# Altium schematic sheet kk_sem_ultrahang_hw.SchDoc
size A3; SheetNumber: 1; SheetTotal: 1
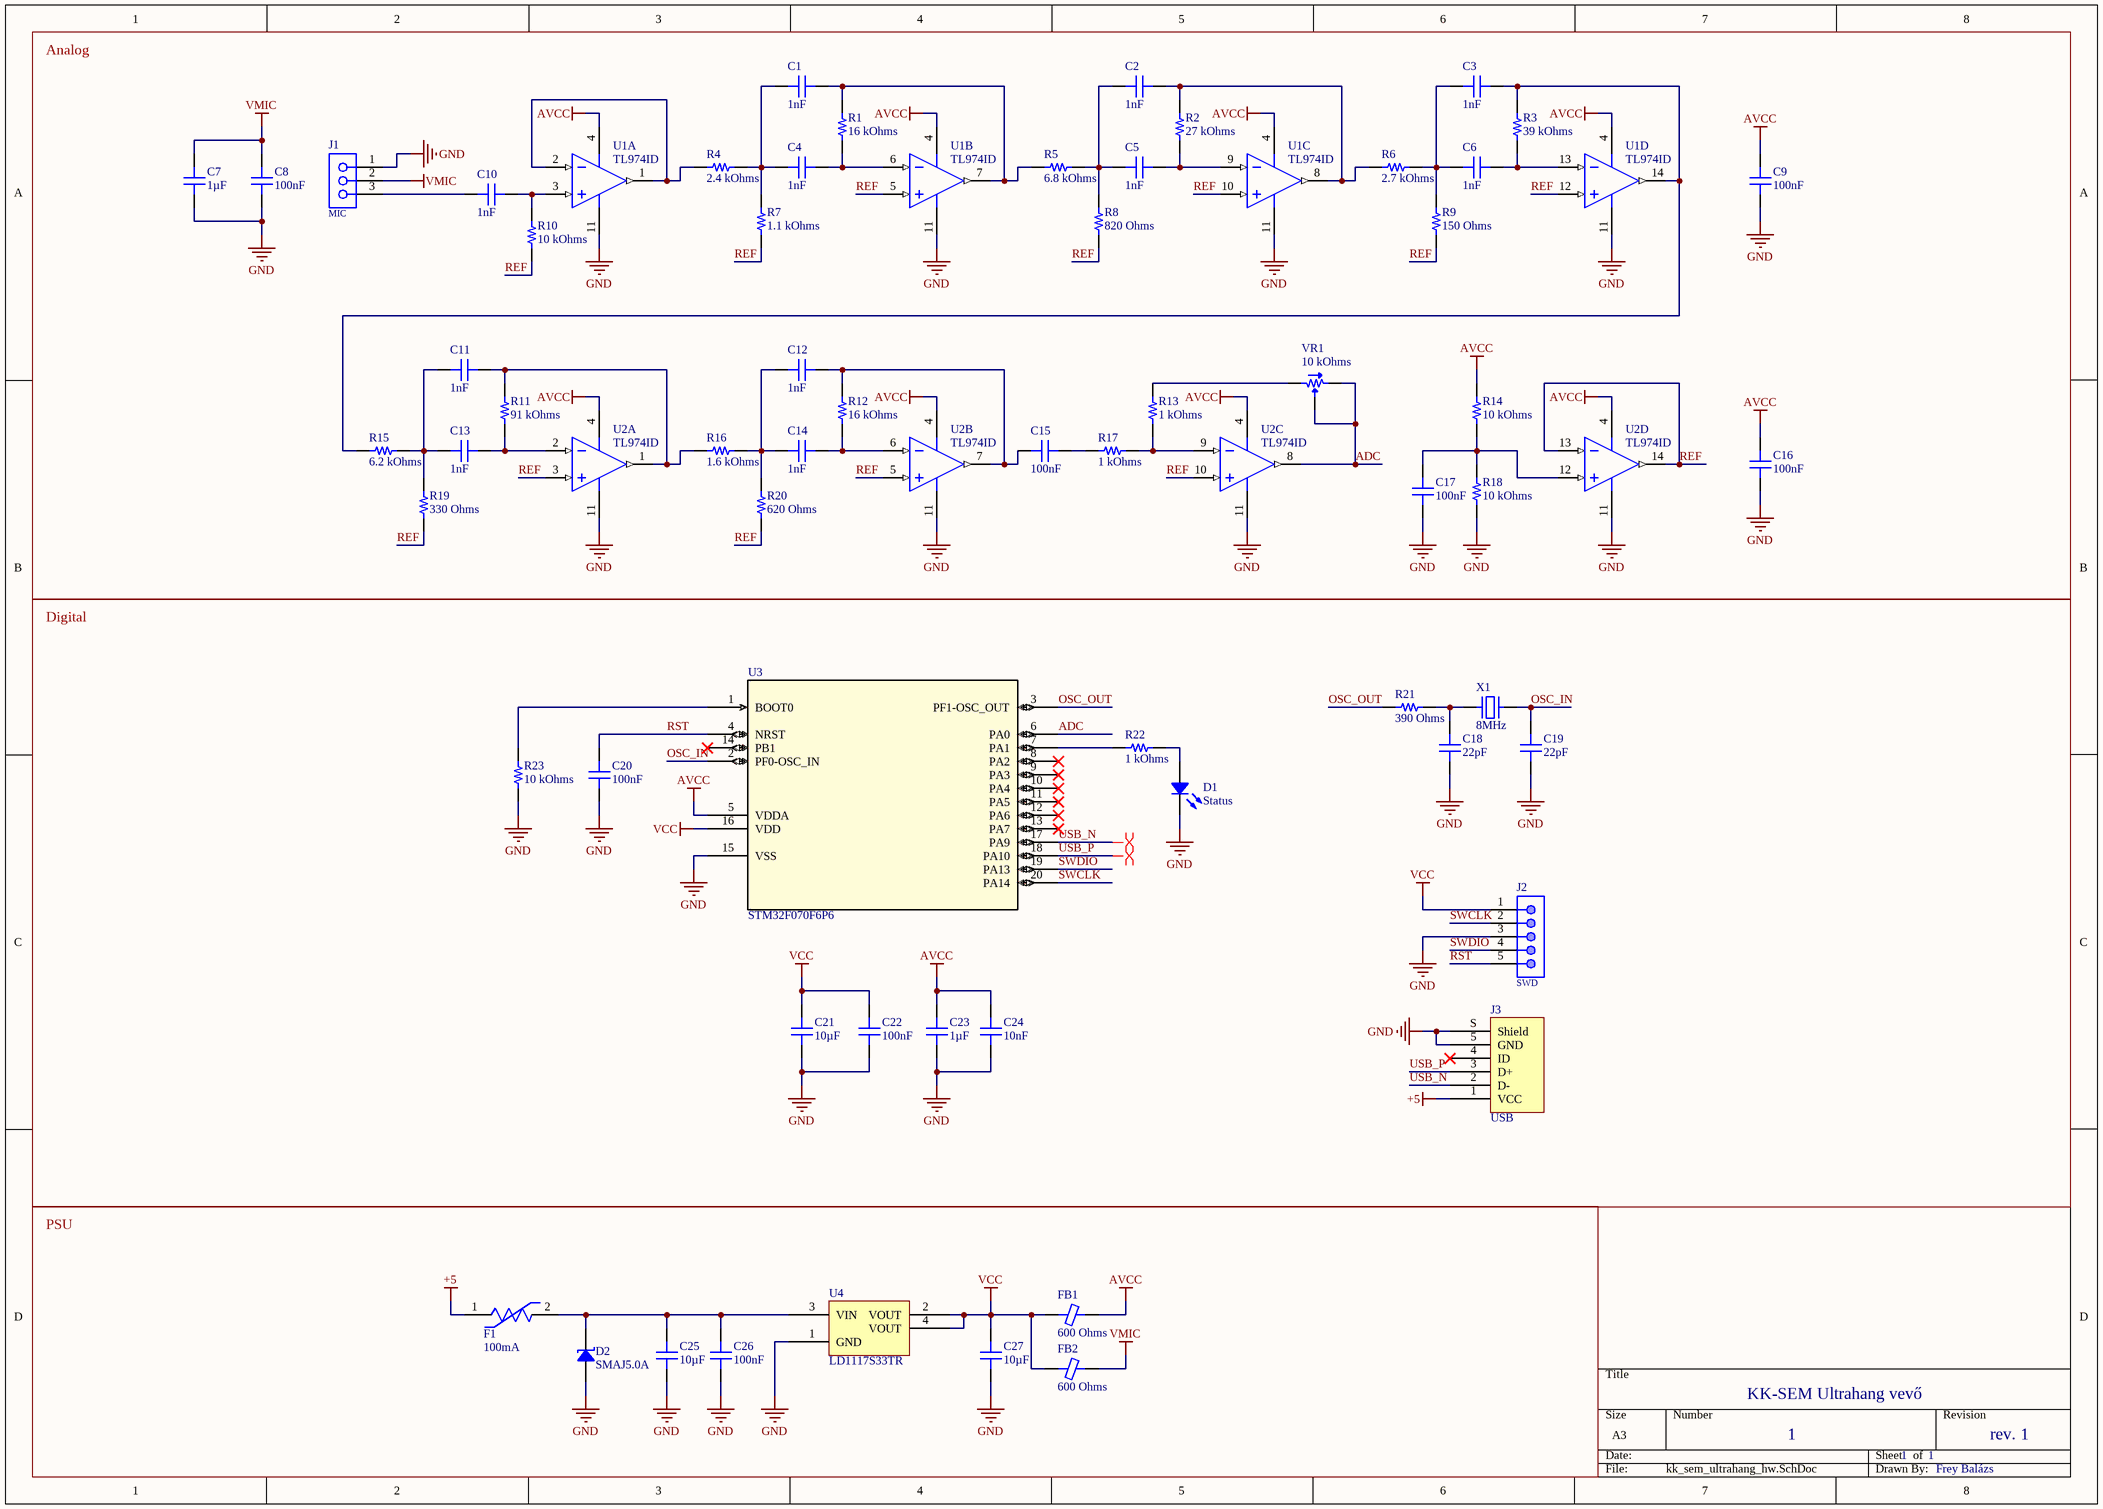
[diagram p0: kk_sem_ultrahang_hw.SchDoc]

## Parts
C1  1nF  [CAP 0805_2012]
C2  1nF  [CAP 0805_2012]
C3  1nF  [CAP 0805_2012]
C4  1nF  [CAP 0805_2012]
C5  1nF  [CAP 0805_2012]
C6  1nF  [CAP 0805_2012]
C7  1µF  [CAP 0805_2012]
C8  100nF  [CAP 0805_2012]
C9  100nF  [CAP 0805_2012]
C10  1nF  [CAP 0805_2012]
C11  1nF  [CAP 0805_2012]
C12  1nF  [CAP 0805_2012]
C13  1nF  [CAP 0805_2012]
C14  1nF  [CAP 0805_2012]
C15  100nF  [CAP 0805_2012]
C16  100nF  [CAP 0805_2012]
C17  100nF  [CAP 0805_2012]
C18  22pF  [CAP 0805_2012]
C19  22pF  [CAP 0805_2012]
C20  100nF  [CAP 0805_2012]
C21  10µF  [CAP 0805_2012]
C22  100nF  [CAP 0805_2012]
C23  1µF  [CAP 0805_2012]
C24  10nF  [CAP 0805_2012]
C25  10µF  [CAP 0805_2012]
C26  100nF  [CAP 0805_2012]
C27  10µF  [CAP 0805_2012]
D1  Status  [LED 0805_2012 GREEN]
D2  SMAJ5.0A  [DO214AC SMA]
F1  100mA  [Littelfuse_1210L_MFG]
FB1  600 Ohms  [FER 0805_2012]
FB2  600 Ohms  [FER 0805_2012]
J1  MIC  [61300311821]
J2  SWD  [61300511121]
J3  USB  [FCI USB 10033526-N3212LF]
R1  16 kOhms  [RES 0805_2012]
R2  27 kOhms  [RES 0805_2012]
R3  39 kOhms  [RES 0805_2012]
R4  2.4 kOhms  [RES 0805_2012]
R5  6.8 kOhms  [RES 0805_2012]
R6  2.7 kOhms  [RES 0805_2012]
R7  1.1 kOhms  [RES 0805_2012]
R8  820 Ohms  [RES 0805_2012]
R9  150 Ohms  [RES 0805_2012]
R10  10 kOhms  [RES 0805_2012]
R11  91 kOhms  [RES 0805_2012]
R12  16 kOhms  [RES 0805_2012]
R13  1 kOhms  [RES 0805_2012]
R14  10 kOhms  [RES 0805_2012]
R15  6.2 kOhms  [RES 0805_2012]
R16  1.6 kOhms  [RES 0805_2012]
R17  1 kOhms  [RES 0805_2012]
R18  10 kOhms  [RES 0805_2012]
R19  330 Ohms  [RES 0805_2012]
R20  620 Ohms  [RES 0805_2012]
R21  390 Ohms  [RES 0805_2012]
R22  1 kOhms  [RES 0805_2012]
R23  10 kOhms  [RES 0805_2012]
U1  TL974ID  [TI-D14_N]  (parts A,B,C,D of 4)
U2  TL974ID  [TI-D14_N]  (parts A,B,C,D of 4)
U3  STM32F070F6P6  [TSSOP20]
U4  LD1117S33TR  [ST SOT-223]
VR1  10 kOhms  [Bourns 3314G-1]
X1  8MHz  [ABRACON ABLS]

## Blocks framed on the sheet
Analog: C1-C17 J1 R1-R20 U1 U2 VR1
Digital: C18-C24 D1 J2 J3 R21-R23 U3 X1
PSU: C25-C27 D2 F1 FB1 FB2 U4

## Nets
+5: F1.1 J3.1(VCC)
AVCC: C9.2 C16.2 C23.2 C24.2 FB1.2 R14.2 U1.4(VCC+) U2.4(VCC+) U3.5(VDDA)
GND: C7.1 C8.1 C9.1 C16.1 C17.1 C18.1 C19.1 C20.1 C21.1 C22.1 C23.1 C24.1 C25.1 C26.1 C27.1 D1.2 D2.1 J1.1 J2.3 J3.5(GND) J3.S(Shield) R18.1 R23.1 U1.11(VCC-) U2.11(VCC-) U3.15(VSS) U4.1(GND)
VCC: C21.2 C22.2 C27.2 FB1.1 FB2.1 J2.1 U3.16(VDD) U4.2(VOUT) U4.4(VOUT)
VMIC: C7.2 C8.2 FB2.2 J1.2
ADC: U2.8(OUT3) U3.6(PA0) VR1.2 VR1.3
OSC_IN: C19.2 U3.2(PF0-OSC_IN) X1.2
OSC_OUT: R21.1 U3.3(PF1-OSC_OUT)
REF: R7.1 R8.1 R9.1 R10.1 R19.1 R20.1 U1.5(IN2+) U1.10(IN3+) U1.12(IN4+) U2.3(IN1+) U2.5(IN2+) U2.10(IN3+) U2.13(IN4-) U2.14(OUT4)
RST: C20.2 J2.5 U3.4(NRST)
SWCLK: J2.2 U3.20(PA14)
SWDIO: J2.4 U3.19(PA13)
USB_N: J3.2(D-) U3.17(PA9)
USB_P: J3.3(D+) U3.18(PA10)
NetC1_1: C1.1 C4.1 R4.2 R7.2
NetC1_2: C1.2 R1.2 R5.1 U1.7(OUT2)
NetC2_1: C2.1 C5.1 R5.2 R8.2
NetC2_2: C2.2 R2.2 R6.1 U1.8(OUT3)
NetC3_1: C3.1 C6.1 R6.2 R9.2
NetC3_2: C3.2 R3.2 R15.1 U1.14(OUT4)
NetC4_2: C4.2 R1.1 U1.6(IN2-)
NetC5_2: C5.2 R2.1 U1.9(IN3-)
NetC6_2: C6.2 R3.1 U1.13(IN4-)
NetC10_1: C10.1 J1.3
NetC10_2: C10.2 R10.2 U1.3(IN1+)
NetC11_1: C11.1 C13.1 R15.2 R19.2
NetC11_2: C11.2 R11.2 R16.1 U2.1(OUT1)
NetC12_1: C12.1 C14.1 R16.2 R20.2
NetC12_2: C12.2 C15.2 R12.2 U2.7(OUT2)
NetC13_2: C13.2 R11.1 U2.2(IN1-)
NetC14_2: C14.2 R12.1 U2.6(IN2-)
NetC15_1: C15.1 R17.1
NetC17_2: C17.2 R14.1 R18.2 U2.12(IN4+)
NetC18_2: C18.2 R21.2 X1.1
NetC25_2: C25.2 C26.2 D2.2 F1.2 U4.3(VIN)
NetD1_1: D1.1 R22.2
NetR4_1: R4.1 U1.1(OUT1) U1.2(IN1-)
NetR13_1: R13.1 R17.2 U2.9(IN3-)
NetR13_2: R13.2 VR1.1
NetR22_1: R22.1 U3.7(PA1)
NetR23_2: R23.2 U3.1(BOOT0)

Not connected (* = marked no-connect by the designer): J3 4(ID)*; U3 8(PA2)* 9(PA3)* 10(PA4)* 11(PA5)* 12(PA6)* 13(PA7)* 14(PB1)*

## Layout directives
differential pair: USB_N, USB_P

## Notes on the sheet
- KK-SEM Ultrahang vevő
- 1
- rev. 1
- Frey Balázs

## Library data of the parts
C1-C6 C10-C14 = C0805C102K5GACTU: CAP CER 1000PF 50V C0G/NP0 0805; Manufacturer: KEMET; Temperature Coefficient: C0G, NP0; Tolerance: ±10%; Part Number: C0805C102K5GACTU; Value: 1nF; Applications: General Purpose; Capacitance: 1000pF; ComponentLink1Description: Datasheet; ComponentLink1URL: https://api.kemet.com/component-edge/download/datasheet/C0805C102K5GACTU.pdf; ComponentLink2Description: DigiKey Link; ComponentLink2URL: http://digikey.com/product-detail/en/kemet/C0805C102K5GACTU/399-7988-1-ND/3471711; Device Package: 0805 (2012 Metric); Features: Low ESL; LastUpdated: 2020. 09. 02. 1:04:42; Lifecycle Status: Active; Minimum Order: 1; Mounting Type: Surface Mount, MLCC; Operating Temperature: -55°C ~ 125°C; Package / Case: 0805 (2012 Metric); Packaging: TapeAndReel; PartId: 2543; Part Status: Active; Price: 0.02; Series: SMD Comm C0G; Size / Dimension: 0.079" L x 0.049" W (2.00mm x 1.25mm); Supplier 1: DigiKey; Supplier Part Number 1: 399-7988-1-ND; Thickness (Max): 0.035" (0.88mm); Voltage - Rated: 50V
C7 C23 = C0805C105K4RACTU: CAP CER 1UF 16V X7R 0805; Manufacturer: KEMET; Tolerance: ±10%; Part Number: C0805C105K4RACTU; Value: 1µF; Applications: Bypass, Decoupling; Capacitance: 1µF; ComponentLink1Description: Datasheet; ComponentLink1URL: https://api.kemet.com/component-edge/download/datasheet/C0805C105K4RACTU.pdf; ComponentLink2Description: DigiKey Link; ComponentLink2URL: http://digikey.com/product-detail/en/kemet/C0805C105K4RACTU/399-1284-1-ND/416060; Device Package: 0805 (2012 Metric); LastUpdated: 2020. 09. 02. 1:04:42; Lifecycle Status: Active; Minimum Order: 1; Mounting Type: Surface Mount, MLCC; Operating Temperature: -55°C ~ 125°C; Package / Case: 0805 (2012 Metric); Packaging: TapeAndReel; PartId: 2494; Part Status: Active; Price: 0.02; Series: SMD Comm X7R; Size / Dimension: 0.079" L x 0.049" W (2.00mm x 1.25mm); Supplier 1: DigiKey; Supplier Part Number 1: 399-1284-1-ND; Temperature Coefficient: X7R; Thickness (Max): 0.039" (1.00mm); Voltage - Rated: 16V
C8 C9 C15-C17 C20 C22 C26 = CC0805MRX7R9BB104: CAP CER 0.1UF 50V X7R 0805; Manufacturer: Yageo; Capacitance: 0.1µF; Tolerance: ±20%; Part Number: CC0805MRX7R9BB104; Value: 100nF; Applications: General Purpose; ComponentLink1Description: Datasheet; ComponentLink1URL: https://www.yageo.com/upload/media/product/productsearch/datasheet/mlcc/UPY-GPHC_X7R_6.3V-to-50V_18.pdf; ComponentLink2Description: DigiKey Link; ComponentLink2URL: http://digikey.com/product-detail/en/yageo/CC0805MRX7R9BB104/311-4351-1-ND/8025440; Device Package: 0805 (2012 Metric); LastUpdated: 2020. 09. 02. 1:04:42; Lifecycle Status: Active; Minimum Order: 1; Mounting Type: Surface Mount, MLCC; Operating Temperature: -55°C ~ 125°C; Package / Case: 0805 (2012 Metric); Packaging: TapeAndReel; PartId: 2475; Part Status: Active; Price: 0.02; Series: CC; Size / Dimension: 0.079" L x 0.049" W (2.00mm x 1.25mm); Supplier 1: DigiKey; Supplier Part Number 1: 311-4351-1-ND; Temperature Coefficient: X7R; Thickness (Max): 0.037" (0.95mm); Voltage - Rated: 50V
C18 C19 = C0805C220J5GACAUTO: CAP CER 22PF 50V C0G/NP0 0805; Manufacturer: KEMET; Temperature Coefficient: C0G, NP0; Tolerance: ±5%; Part Number: C0805C220J5GACAUTO; Value: 22pF; Applications: Automotive; Capacitance: 22pF; ComponentLink1Description: Datasheet; ComponentLink1URL: https://api.kemet.com/component-edge/download/datasheet/C0805C220J5GACAUTO.pdf; ComponentLink2Description: DigiKey Link; ComponentLink2URL: http://digikey.com/product-detail/en/kemet/C0805C220J5GACAUTO/399-6937-1-ND/3314446; Device Package: 0805 (2012 Metric); Features: Low ESL; LastUpdated: 2020. 09. 02. 1:04:42; Lifecycle Status: Active; Minimum Order: 1; Mounting Type: Surface Mount, MLCC; Operating Temperature: -55°C ~ 125°C; Package / Case: 0805 (2012 Metric); Packaging: TapeAndReel; PartId: 2537; Part Status: Active; Price: 0.02; Ratings: AEC-Q200; Series: SMD Auto C0G; Size / Dimension: 0.079" L x 0.049" W (2.00mm x 1.25mm); Supplier 1: DigiKey; Supplier Part Number 1: 399-6937-1-ND; Thickness (Max): 0.035" (0.88mm); Voltage - Rated: 50V
C21 C25 C27 = CGA4J1X5R1C106K125AC: CAP CER 10UF 16V X5R 0805; Manufacturer: TDK Corporation; Tolerance: ±10%; Part Number: CGA4J1X5R1C106K125AC; Value: 10µF; Applications: Automotive; Capacitance: 10µF; ComponentLink1Description: Datasheet; ComponentLink1URL: https://product.tdk.com/info/en/catalog/datasheets/mlcc_automotive_general_en.pdf?ref_disty=digikey; ComponentLink2Description: DigiKey Link; ComponentLink2URL: http://digikey.com/product-detail/en/tdk-corporation/CGA4J1X5R1C106K125AC/445-7883-1-ND/2781387; Device Package: 0805 (2012 Metric); LastUpdated: 2020. 09. 02. 1:04:41; Lifecycle Status: Active; Minimum Order: 1; Mounting Type: Surface Mount, MLCC; Operating Temperature: -55°C ~ 85°C; Package / Case: 0805 (2012 Metric); Packaging: TapeAndReel; PartId: 3076; Part Status: Active; Price: 0.11; Ratings: AEC-Q200; Series: CGA; Size / Dimension: 0.079" L x 0.049" W (2.00mm x 1.25mm); Supplier 1: DigiKey; Supplier Part Number 1: 445-7883-1-ND; Temperature Coefficient: X5R; Thickness (Max): 0.057" (1.45mm); Voltage - Rated: 16V
C24 = C0805F103K5RACTU: CAP CER 10000PF 50V X7R 0805; Manufacturer: KEMET; Tolerance: ±10%; Part Number: C0805F103K5RACTU; Value: 10nF; Applications: General Purpose; Capacitance: 10000pF; ComponentLink1Description: Datasheet; ComponentLink1URL: https://api.kemet.com/component-edge/download/datasheet/C0805F103K5RACTU.pdf; ComponentLink2Description: DigiKey Link; ComponentLink2URL: http://digikey.com/product-detail/en/kemet/C0805F103K5RACTU/399-5107-1-ND/1465632; Device Package: 0805 (2012 Metric); Features: Open Mode; LastUpdated: 2020. 09. 02. 1:04:41; Lifecycle Status: Active; Minimum Order: 1; Mounting Type: Surface Mount, MLCC; Operating Temperature: -55°C ~ 125°C; Package / Case: 0805 (2012 Metric); Packaging: TapeAndReel; PartId: 2679; Part Status: Active; Price: 0.08; Series: SMD Comm X7R FO; Size / Dimension: 0.079" L x 0.049" W (2.00mm x 1.25mm); Supplier 1: DigiKey; Supplier Part Number 1: 399-5107-1-ND; Temperature Coefficient: X7R; Thickness (Max): 0.039" (1.00mm); Voltage - Rated: 50V
D1 = 5975316507F: LED GREEN 0805 SMD; Manufacturer: Dialight; Configuration: Standard; Current - Test: 20mA; Lens Color: 0.93mm; Lens Size: 1.40mm x 1.24mm; Lens Style: Rectangle with Flat Top; Millicandela Rating: 16mcd; Voltage - Forward (Vf) (Typ): 2.2V; Wavelength - Dominant: 560nm; Part Number: 5975316507F; Color: Green; ComponentLink1Description: Datasheet; ComponentLink1URL: http://www.dialightsignalsandcomponents.com/Assets/Drawings/2D_Drawings_DrawingDetailedSpec/NewDrawings/18370A.pdf; ComponentLink2Description: DigiKey Link; ComponentLink2URL: http://digikey.com/product-detail/en/dialight/5975316507F/350-4389-1-ND/9385495; Device Package: 0805 (2012 Metric); Height (Max): 0.93mm; LastUpdated: 2020. 09. 02. 1:21:05; Lifecycle Status: Active; Minimum Order: 1; Mounting Type: Surface Mount; Package / Case: 0805 (2012 Metric); Packaging: TapeAndReel; PartId: 245; Part Status: Active; Price: 0.15; Series: 597; Size / Dimension: 2.00mm L x 1.25mm W; Supplier 1: DigiKey; Supplier Part Number 1: 350-4389-1-ND; Supplier Device Package: 0805; Value: Green
D2 = SMAJ5.0A: TVS DIODE 5V 9.2V DO214AC; Manufacturer: Littelfuse Inc.; Current - Peak Pulse (10/1000µs): 43.5A; Power Line Protection: No; Power - Peak Pulse: 400W; Type: Zener; Unidirectional Channels: 1; Voltage - Breakdown (Min): 6.4V; Part Number: SMAJ5.0A; Applications: General Purpose; ComponentLink1Description: Datasheet; ComponentLink1URL: https://www.littelfuse.com/~/media/electronics/datasheets/tvs_diodes/littelfuse_tvs_diode_smaj_datasheet.pdf.pdf; ComponentLink2Description: DigiKey Link; ComponentLink2URL: http://digikey.com/product-detail/en/littelfuse-inc/SMAJ5.0A/SMAJ5.0ALFCT-ND/762462; LastUpdated: 2020. 09. 02. 1:20:14; Lifecycle Status: Active; Minimum Order: 1; Mounting Type: Surface Mount; Operating Temperature: -65°C ~ 150°C (TJ); Package / Case: DO-214AC, SMA; Packaging: TapeAndReel; PartId: 5719; Part Status: Active; Price: 0.08; Series: SMAJ; Supplier 1: DigiKey; Supplier Part Number 1: SMAJ5.0ALFCT-ND; Supplier Device Package: DO-214AC (SMA); Voltage - Clamping (Max) @ Ipp: 9.2V; Voltage - Reverse Standoff (Typ): 5V
F1 = 1210L020WR: FUSE PTC RESET FUSE 30V 200MA 1210; Manufacturer: Littelfuse; Current Rating: 10A; Hold Current: 0.2A; Resistance: 0.8-5Ω; Trip Current: 0.4A; Trip Time: 0.02s; Value: 0.8-5Ω; Verification Version: 0.0.0.3; Datasheet Path: datasheets/Fuse_Littelfuse_1210L020WR_eec.pdf; Ambient Temperature Range High: +85°C; Ambient Temperature Range Low: -40°C; Automotive: No; ComponentLink1Description: Upverter; ComponentLink1URL: https://upverter.com/part/id/505f513f166b17e4/; ComponentLink2Description: Datasheet; ComponentLink2URL: https://m.littelfuse.com/~/media/electronics/datasheets/resettable_ptcs/littelfuse_ptc_1210l_datasheet.pdf.pdf; Digikey Description: FUSE PTC RESET FUSE 30V 200MA 1210; Digikey Part Number: F3350CT-ND; Height: 1mm; Lead Free: Yes; Mouser Description: PTC Resettable Fuse 0.2A(hold) 0.4A(trip) 30VDC 10A 0.6W 0.02s 0.8Ohm SMD Solder Pad 1210 T/R; Mouser Part Number: 576-1210L020WR; Package: 1210L; Part Number: 1210L020WR; RoHS: TRUE; Supplier 1: Digi-Key; Supplier 2: Mouser; Supplier Part Number 1: F3350CT-ND; Supplier Part Number 2: 576-1210L020WR; Temperature: -40°C to +85°C; Temperature Range High: +85°C; Temperature Range Low: -40°C; Voltage Rating: 30V; helpURL: https://upverter.com/part/id/505f513f166b17e4/
FB1 FB2 = BBPY00201209601Y00: EMI BEAD FILETER; Manufacturer: Chilisin Electronics; Current Rating (Max): 2A; DC Resistance (DCR) (Max): 100mOhm; Impedance @ Frequency: 600 Ohms @ 100MHz; Number of Lines: 1; Part Number: BBPY00201209601Y00; ComponentLink1Description: Datasheet; ComponentLink1URL: https://www.chilisin.com/upload/media/product/emi_bead/file/BBPY_Series.pdf; ComponentLink2Description: DigiKey Link; ComponentLink2URL: http://digikey.com/product-detail/en/chilisin-electronics/BBPY00201209601Y00/2184-BBPY00201209601Y00CT-ND/10498864; Device Package: 0805 (2012 Metric); LastUpdated: 2020. 09. 02. 1:18:21; Lifecycle Status: Active; Minimum Order: 1; Mounting Type: Surface Mount; Operating Temperature: -55°C ~ 125°C; Package / Case: 0805 (2012 Metric); Packaging: Unknown; PartId: 1846; Part Status: Active; Price: 0.02; Series: *; Supplier 1: DigiKey; Supplier Part Number 1: 2184-BBPY00201209601Y00CT-ND; Value: 600 Ohms
J1 = 61300311821: WR-PHD Socket Header, THT, pitch 2.54mm, Single Row, Vertical, 3p; Manufacturer: Wurth Elektronik; Pin Number: 3; Rated Current: 3A; Working Voltage: 250VAC; Withstanding Voltage: 500VAC; Contact Resistance: 20mOhm; ComponentLink1Description: Manufacturer; ComponentLink1URL: http://www.we-online.de; ComponentLink2Description: Datasheet; ComponentLink2URL: https://www.we-online.com/catalog/datasheet/61300311821.pdf; Manufacturer Part Number: 61300311821; Published Date: May 2020; Pitch: 2.54mm; Operating Temperature: -40 to +125degC; Mounting Technology: THT; Packaging: Tray; Gender: Socket Header; Row Number: Single; Orientation: Vertical
J2 = 61300511121: WR-PHD Pin Header, THT, pitch 2.54mm, Single Row, Vertical, 5p; Manufacturer: Wurth Elektronik; Pin Number: 5; Rated Current: 3A; Working Voltage: 250VAC; Withstanding Voltage: 500VAC; Contact Resistance: 20mOhm; ComponentLink1Description: Manufacturer; ComponentLink1URL: http://www.we-online.de; ComponentLink2Description: Datasheet; ComponentLink2URL: https://www.we-online.com/catalog/datasheet/61300511121.pdf; Manufacturer Part Number: 61300511121; Published Date: May 2020; Pitch: 2.54mm; Operating Temperature: -40 to +105degC; Mounting Technology: THT; Packaging: Bag; Gender: Pin Header; Row Number: Single; Orientation: Vertical
J3 = 10033526-N3212LF: CONN RCPT MINI USB B 5POS SMD RA; Manufacturer: Amphenol ICC (FCI); Connector Type: USB - mini B; Current Rating (Amps): 1A per Contact; Gender: Receptacle; Mating Cycles: 5000; Number of Contacts: 5; Number of Ports: 1; Shielding: Shielded; Voltage - Rated: 30V; Part Number: 10033526-N3212LF; ComponentLink1Description: Datasheet; ComponentLink1URL: http://www.amphenol-icc.com/media/wysiwyg/files/drawing/10033526.pdf; ComponentLink2Description: DigiKey Link; ComponentLink2URL: //digikey.com/product-detail/en/amphenol-icc-fci/10033526-N3212LF/609-4700-2-ND/4292074; Features: Board Guide, Solder Retention; LastUpdated: 2019. 12. 09. 20:52:14; Lifecycle Status: 0; Minimum Order: 1; Mounting Feature: Horizontal; Mounting Type: Surface Mount, Right Angle; Operating Temperature: -25°C ~ 85°C; Packaging: TapeAndReel; Part Status: Active; Price: 0.39; Series: -; Supplier 1: DigiKey; Supplier Part Number 1: 609-4700-2-ND; Termination: Solder
R1 R12 = CRCW080516K0FKEA: RES SMD 16K OHM 1% 1/8W 0805; Manufacturer: Vishay Dale; Power (Watts): 0.125W, 1/8W; Temperature Coefficient: ±100ppm/°C; Part Number: CRCW080516K0FKEA; Value: 16 kOhms; ComponentLink1Description: Datasheet; ComponentLink1URL: http://www.vishay.com/docs/20035/dcrcwe3.pdf; ComponentLink2Description: DigiKey Link; ComponentLink2URL: http://digikey.com/product-detail/en/vishay-dale/CRCW080516K0FKEA/541-16.0KCCT-ND/1180918; Composition: Thick Film; Device Package: 0805 (2012 Metric); Features: Automotive AEC-Q200; Height - Seated (Max): 0.020" (0.50mm); LastUpdated: 2020. 09. 02. 1:15:13; Lifecycle Status: Active; Minimum Order: 1; Number of Terminations: 2; Operating Temperature: -55°C ~ 155°C; Package / Case: 0805 (2012 Metric); Packaging: TapeAndReel; PartId: 32798; Part Status: Active; Price: 0.01; Ratings: AEC-Q200; Resistance: 16 kOhms; Series: CRCW; Size / Dimension: 0.079" L x 0.049" W (2.00mm x 1.25mm); Supplier 1: DigiKey; Supplier Part Number 1: 541-16.0KCCT-ND; Supplier Device Package: 0805; Tolerance: ±1%
R2 = ERJ-6ENF2702V: RES SMD 27K OHM 1% 1/8W 0805; Manufacturer: Panasonic Electronic Components; Power (Watts): 0.125W, 1/8W; Temperature Coefficient: ±100ppm/°C; Part Number: ERJ-6ENF2702V; Value: 27 kOhms; ComponentLink1Description: Datasheet; ComponentLink1URL: https://industrial.panasonic.com/cdbs/www-data/pdf/RDA0000/AOA0000C304.pdf; ComponentLink2Description: DigiKey Link; ComponentLink2URL: http://digikey.com/product-detail/en/panasonic-electronic-components/ERJ-6ENF2702V/P27.0KCCT-ND/1746843; Composition: Thick Film; Device Package: 0805 (2012 Metric); Features: Automotive AEC-Q200; Height - Seated (Max): 0.028" (0.70mm); LastUpdated: 2020. 09. 02. 1:15:19; Lifecycle Status: Active; Minimum Order: 1; Number of Terminations: 2; Operating Temperature: -55°C ~ 155°C; Package / Case: 0805 (2012 Metric); Packaging: TapeAndReel; PartId: 30271; Part Status: Active; Price: 0.01; Ratings: AEC-Q200; Resistance: 27 kOhms; Series: ERJ; Size / Dimension: 0.079" L x 0.049" W (2.00mm x 1.25mm); Supplier 1: DigiKey; Supplier Part Number 1: P27.0KCCT-ND; Supplier Device Package: 0805; Tolerance: ±1%
R3 = AC0805FR-0739KL: RES SMD 39K OHM 1% 1/8W 0805; Manufacturer: Yageo; Power (Watts): 0.125W, 1/8W; Temperature Coefficient: ±100ppm/°C; Part Number: AC0805FR-0739KL; Value: 39 kOhms; ComponentLink1Description: Datasheet; ComponentLink1URL: https://www.yageo.com/upload/media/product/productsearch/datasheet/rchip/PYu-AC_51_RoHS_L_7.pdf; ComponentLink2Description: DigiKey Link; ComponentLink2URL: http://digikey.com/product-detail/en/yageo/AC0805FR-0739KL/YAG3727CT-ND/6006576; Composition: Thick Film; Device Package: 0805 (2012 Metric); Features: Automotive AEC-Q200, Moisture Resistant; Height - Seated (Max): 0.024" (0.60mm); LastUpdated: 2020. 09. 02. 1:15:24; Lifecycle Status: Active; Minimum Order: 1; Number of Terminations: 2; Operating Temperature: -55°C ~ 155°C; Package / Case: 0805 (2012 Metric); Packaging: TapeAndReel; PartId: 27853; Part Status: Active; Price: 0.01; Ratings: AEC-Q200; Resistance: 39 kOhms; Series: AC; Size / Dimension: 0.079" L x 0.049" W (2.00mm x 1.25mm); Supplier 1: DigiKey; Supplier Part Number 1: YAG3727CT-ND; Supplier Device Package: 0805; Tolerance: ±1%
R4 = KTR10EZPF2401: RES SMD 2.4K OHM 1% 1/8W 0805; Manufacturer: Rohm Semiconductor; Power (Watts): 0.125W, 1/8W; Temperature Coefficient: ±100ppm/°C; Part Number: KTR10EZPF2401; Value: 2.4 kOhms; ComponentLink1Description: Datasheet; ComponentLink1URL: https://www.rohm.com/datasheet/KTR03EZPF/ktr-e; ComponentLink2Description: DigiKey Link; ComponentLink2URL: http://digikey.com/product-detail/en/rohm-semiconductor/KTR10EZPF2401/RHM2.4KAHCT-ND/4054431; Composition: Thick Film; Device Package: 0805 (2012 Metric); Features: Automotive AEC-Q200, High Voltage; Height - Seated (Max): 0.026" (0.65mm); LastUpdated: 2020. 09. 02. 1:15:21; Lifecycle Status: Active; Minimum Order: 1; Number of Terminations: 2; Operating Temperature: -55°C ~ 155°C; Package / Case: 0805 (2012 Metric); Packaging: TapeAndReel; PartId: 29182; Part Status: Active; Price: 0.02; Ratings: AEC-Q200; Resistance: 2.4 kOhms; Series: KTR; Size / Dimension: 0.079" L x 0.049" W (2.00mm x 1.25mm); Supplier 1: DigiKey; Supplier Part Number 1: RHM2.4KAHCT-ND; Supplier Device Package: 0805; Tolerance: ±1%
R5 = ERJ-6ENF6801V: RES SMD 6.8K OHM 1% 1/8W 0805; Manufacturer: Panasonic Electronic Components; Power (Watts): 0.125W, 1/8W; Temperature Coefficient: ±100ppm/°C; Part Number: ERJ-6ENF6801V; Value: 6.8 kOhms; ComponentLink1Description: Datasheet; ComponentLink1URL: https://industrial.panasonic.com/cdbs/www-data/pdf/RDA0000/AOA0000C304.pdf; ComponentLink2Description: DigiKey Link; ComponentLink2URL: http://digikey.com/product-detail/en/panasonic-electronic-components/ERJ-6ENF6801V/P6.80KCCT-ND/1746892; Composition: Thick Film; Device Package: 0805 (2012 Metric); Features: Automotive AEC-Q200; Height - Seated (Max): 0.028" (0.70mm); LastUpdated: 2020. 09. 02. 1:15:19; Lifecycle Status: Active; Minimum Order: 1; Number of Terminations: 2; Operating Temperature: -55°C ~ 155°C; Package / Case: 0805 (2012 Metric); Packaging: TapeAndReel; PartId: 30159; Part Status: Active; Price: 0.01; Ratings: AEC-Q200; Resistance: 6.8 kOhms; Series: ERJ; Size / Dimension: 0.079" L x 0.049" W (2.00mm x 1.25mm); Supplier 1: DigiKey; Supplier Part Number 1: P6.80KCCT-ND; Supplier Device Package: 0805; Tolerance: ±1%
R6 = CR0805-FX-2701ELF: RES SMD 2.7K OHM 1% 1/8W 0805; Manufacturer: Bourns Inc.; Power (Watts): 0.125W, 1/8W; Temperature Coefficient: ±100ppm/°C; Part Number: CR0805-FX-2701ELF; Value: 2.7 kOhms; ComponentLink1Description: Datasheet; ComponentLink1URL: https://www.bourns.com/docs/Product-Datasheets/CHPREZTR.pdf; ComponentLink2Description: DigiKey Link; ComponentLink2URL: http://digikey.com/product-detail/en/bourns-inc/CR0805-FX-2701ELF/CR0805-FX-2701ELFCT-ND/4247920; Composition: Thick Film; Device Package: 0805 (2012 Metric); Features: Moisture Resistant; Height - Seated (Max): 0.024" (0.60mm); LastUpdated: 2020. 09. 02. 1:15:14; Lifecycle Status: Active; Minimum Order: 1; Number of Terminations: 2; Operating Temperature: -55°C ~ 155°C; Package / Case: 0805 (2012 Metric); Packaging: CutTape; PartId: 32518; Part Status: Active; Price: 0.10; Resistance: 2.7 kOhms; Series: CR0805; Size / Dimension: 0.079" L x 0.049" W (2.00mm x 1.25mm); Supplier 1: DigiKey; Supplier Part Number 1: CR0805-FX-2701ELFCT-ND; Supplier Device Package: 0805; Tolerance: ±1%
R7 = RMCF0805FG1K10: RES 1.1K OHM 1% 1/8W 0805; Manufacturer: Stackpole Electronics Inc; Power (Watts): 0.125W, 1/8W; Temperature Coefficient: ±100ppm/°C; Part Number: RMCF0805FG1K10; Value: 1.1 kOhms; ComponentLink1Description: Datasheet; ComponentLink1URL: https://www.seielect.com/catalog/sei-rmcf_rmcp.pdf; ComponentLink2Description: DigiKey Link; ComponentLink2URL: http://digikey.com/product-detail/en/stackpole-electronics-inc/RMCF0805FG1K10/RMCF0805FG1K10CT-ND/4425147; Composition: Thick Film; Device Package: 0805 (2012 Metric); Features: Automotive AEC-Q200; Height - Seated (Max): 0.026" (0.65mm); LastUpdated: 2020. 09. 02. 1:15:22; Lifecycle Status: Active; Minimum Order: 1; Number of Terminations: 2; Operating Temperature: -55°C ~ 155°C; Package / Case: 0805 (2012 Metric); Packaging: CutTape; PartId: 28907; Part Status: Active; Price: 0.10; Ratings: AEC-Q200; Resistance: 1.1 kOhms; Series: RMCF; Size / Dimension: 0.079" L x 0.049" W (2.00mm x 1.25mm); Supplier 1: DigiKey; Supplier Part Number 1: RMCF0805FG1K10CT-ND; Supplier Device Package: 0805; Tolerance: ±1%
R8 = RMCF0805FT820R: RES 820 OHM 1% 1/8W 0805; Manufacturer: Stackpole Electronics Inc; Power (Watts): 0.125W, 1/8W; Temperature Coefficient: ±100ppm/°C; Part Number: RMCF0805FT820R; Value: 820 Ohms; ComponentLink1Description: Datasheet; ComponentLink1URL: https://www.seielect.com/catalog/sei-rmcf_rmcp.pdf; ComponentLink2Description: DigiKey Link; ComponentLink2URL: http://digikey.com/product-detail/en/stackpole-electronics-inc/RMCF0805FT820R/RMCF0805FT820RCT-ND/2418471; Composition: Thick Film; Device Package: 0805 (2012 Metric); Features: Automotive AEC-Q200; Height - Seated (Max): 0.026" (0.65mm); LastUpdated: 2020. 09. 02. 1:15:14; Lifecycle Status: Active; Minimum Order: 1; Number of Terminations: 2; Operating Temperature: -55°C ~ 155°C; Package / Case: 0805 (2012 Metric); Packaging: CutTape; PartId: 32515; Part Status: Active; Price: 0.10; Ratings: AEC-Q200; Resistance: 820 Ohms; Series: RMCF; Size / Dimension: 0.079" L x 0.049" W (2.00mm x 1.25mm); Supplier 1: DigiKey; Supplier Part Number 1: RMCF0805FT820RCT-ND; Supplier Device Package: 0805; Tolerance: ±1%
R9 = RMCF0805FT150R: RES 150 OHM 1% 1/8W 0805; Manufacturer: Stackpole Electronics Inc; Power (Watts): 0.125W, 1/8W; Temperature Coefficient: ±100ppm/°C; Part Number: RMCF0805FT150R; Value: 150 Ohms; ComponentLink1Description: Datasheet; ComponentLink1URL: https://www.seielect.com/catalog/sei-rmcf_rmcp.pdf; ComponentLink2Description: DigiKey Link; ComponentLink2URL: http://digikey.com/product-detail/en/stackpole-electronics-inc/RMCF0805FT150R/RMCF0805FT150RCT-ND/1942337; Composition: Thick Film; Device Package: 0805 (2012 Metric); Features: Automotive AEC-Q200; Height - Seated (Max): 0.026" (0.65mm); LastUpdated: 2020. 09. 02. 1:15:14; Lifecycle Status: Active; Minimum Order: 1; Number of Terminations: 2; Operating Temperature: -55°C ~ 155°C; Package / Case: 0805 (2012 Metric); Packaging: CutTape; PartId: 32414; Part Status: Active; Price: 0.10; Ratings: AEC-Q200; Resistance: 150 Ohms; Series: RMCF; Size / Dimension: 0.079" L x 0.049" W (2.00mm x 1.25mm); Supplier 1: DigiKey; Supplier Part Number 1: RMCF0805FT150RCT-ND; Supplier Device Package: 0805; Tolerance: ±1%
R10 R14 R18 R23 = CRGCQ0805F10K: CRGCQ 0805 10K 1%; Manufacturer: TE Connectivity Passive Product; Power (Watts): 0.125W, 1/8W; Temperature Coefficient: ±100ppm/°C; Part Number: CRGCQ0805F10K; Value: 10 kOhms; ComponentLink1Description: Datasheet; ComponentLink1URL: https://www.te.com/commerce/DocumentDelivery/DDEController?Action=srchrtrv&DocNm=1773204-3&DocType=DS&DocLang=English; ComponentLink2Description: DigiKey Link; ComponentLink2URL: http://digikey.com/product-detail/en/te-connectivity-passive-product/CRGCQ0805F10K/A129761CT-ND/8577593; Composition: Thick Film; Device Package: 0805 (2012 Metric); Features: Automotive AEC-Q200, Moisture Resistant; Height - Seated (Max): 0.026" (0.65mm); LastUpdated: 2020. 09. 02. 1:14:36; Lifecycle Status: Active; Minimum Order: 1; Number of Terminations: 2; Operating Temperature: -55°C ~ 155°C; Package / Case: 0805 (2012 Metric); Packaging: TapeAndReel; PartId: 47653; Part Status: Active; Price: 0.01; Ratings: AEC-Q200; Resistance: 10 kOhms; Series: CRGCQ; Size / Dimension: 0.079" L x 0.049" W (2.00mm x 1.25mm); Supplier 1: DigiKey; Supplier Part Number 1: A129761CT-ND; Supplier Device Package: 0805; Tolerance: ±1%
R11 = CRCW080591K0FKEA: RES SMD 91K OHM 1% 1/8W 0805; Manufacturer: Vishay Dale; Power (Watts): 0.125W, 1/8W; Temperature Coefficient: ±100ppm/°C; Part Number: CRCW080591K0FKEA; Value: 91 kOhms; ComponentLink1Description: Datasheet; ComponentLink1URL: http://www.vishay.com/docs/20035/dcrcwe3.pdf; ComponentLink2Description: DigiKey Link; ComponentLink2URL: http://digikey.com/product-detail/en/vishay-dale/CRCW080591K0FKEA/541-91.0KCCT-ND/1181009; Composition: Thick Film; Device Package: 0805 (2012 Metric); Features: Automotive AEC-Q200; Height - Seated (Max): 0.020" (0.50mm); LastUpdated: 2020. 09. 02. 1:15:06; Lifecycle Status: Active; Minimum Order: 1; Number of Terminations: 2; Operating Temperature: -55°C ~ 155°C; Package / Case: 0805 (2012 Metric); Packaging: TapeAndReel; PartId: 35946; Part Status: Active; Price: 0.01; Ratings: AEC-Q200; Resistance: 91 kOhms; Series: CRCW; Size / Dimension: 0.079" L x 0.049" W (2.00mm x 1.25mm); Supplier 1: DigiKey; Supplier Part Number 1: 541-91.0KCCT-ND; Supplier Device Package: 0805; Tolerance: ±1%
R13 R17 R22 = CRCW08051K00FKEA: RES SMD 1K OHM 1% 1/8W 0805; Manufacturer: Vishay Dale; Power (Watts): 0.125W, 1/8W; Temperature Coefficient: ±100ppm/°C; Part Number: CRCW08051K00FKEA; Value: 1 kOhms; ComponentLink1Description: Datasheet; ComponentLink1URL: http://www.vishay.com/docs/20035/dcrcwe3.pdf; ComponentLink2Description: DigiKey Link; ComponentLink2URL: http://digikey.com/product-detail/en/vishay-dale/CRCW08051K00FKEA/541-1.00KCCT-ND/1180783; Composition: Thick Film; Device Package: 0805 (2012 Metric); Features: Automotive AEC-Q200; Height - Seated (Max): 0.020" (0.50mm); LastUpdated: 2020. 09. 02. 1:15:23; Lifecycle Status: Active; Minimum Order: 1; Number of Terminations: 2; Operating Temperature: -55°C ~ 155°C; Package / Case: 0805 (2012 Metric); Packaging: TapeAndReel; PartId: 28103; Part Status: Active; Price: 0.01; Ratings: AEC-Q200; Resistance: 1 kOhms; Series: CRCW; Size / Dimension: 0.079" L x 0.049" W (2.00mm x 1.25mm); Supplier 1: DigiKey; Supplier Part Number 1: 541-1.00KCCT-ND; Supplier Device Package: 0805; Tolerance: ±1%
R15 = RMCF0805FT6K20: RES 6.2K OHM 1% 1/8W 0805; Manufacturer: Stackpole Electronics Inc; Power (Watts): 0.125W, 1/8W; Temperature Coefficient: ±100ppm/°C; Part Number: RMCF0805FT6K20; Value: 6.2 kOhms; ComponentLink1Description: Datasheet; ComponentLink1URL: https://www.seielect.com/catalog/sei-rmcf_rmcp.pdf; ComponentLink2Description: DigiKey Link; ComponentLink2URL: http://digikey.com/product-detail/en/stackpole-electronics-inc/RMCF0805FT6K20/RMCF0805FT6K20CT-ND/2418453; Composition: Thick Film; Device Package: 0805 (2012 Metric); Features: Automotive AEC-Q200; Height - Seated (Max): 0.026" (0.65mm); LastUpdated: 2020. 09. 02. 1:15:14; Lifecycle Status: Active; Minimum Order: 1; Number of Terminations: 2; Operating Temperature: -55°C ~ 155°C; Package / Case: 0805 (2012 Metric); Packaging: CutTape; PartId: 32585; Part Status: Active; Price: 0.10; Ratings: AEC-Q200; Resistance: 6.2 kOhms; Series: RMCF; Size / Dimension: 0.079" L x 0.049" W (2.00mm x 1.25mm); Supplier 1: DigiKey; Supplier Part Number 1: RMCF0805FT6K20CT-ND; Supplier Device Package: 0805; Tolerance: ±1%
R16 = AC0805FR-071K6L: RES SMD 1.6K OHM 1% 1/8W 0805; Manufacturer: Yageo; Power (Watts): 0.125W, 1/8W; Temperature Coefficient: ±100ppm/°C; Part Number: AC0805FR-071K6L; Value: 1.6 kOhms; ComponentLink1Description: Datasheet; ComponentLink1URL: https://www.yageo.com/upload/media/product/productsearch/datasheet/rchip/PYu-AC_51_RoHS_L_7.pdf; ComponentLink2Description: DigiKey Link; ComponentLink2URL: http://digikey.com/product-detail/en/yageo/AC0805FR-071K6L/YAG5709CT-ND/7648586; Composition: Thick Film; Device Package: 0805 (2012 Metric); Features: Automotive AEC-Q200, Moisture Resistant; Height - Seated (Max): 0.024" (0.60mm); LastUpdated: 2020. 09. 02. 1:15:15; Lifecycle Status: Active; Minimum Order: 1; Number of Terminations: 2; Operating Temperature: -55°C ~ 155°C; Package / Case: 0805 (2012 Metric); Packaging: TapeAndReel; PartId: 31712; Part Status: Active; Price: 0.01; Ratings: AEC-Q200; Resistance: 1.6 kOhms; Series: AC; Size / Dimension: 0.079" L x 0.049" W (2.00mm x 1.25mm); Supplier 1: DigiKey; Supplier Part Number 1: YAG5709CT-ND; Supplier Device Package: 0805; Tolerance: ±1%
R19 = RC0805FR-07330RL: RES SMD 330 OHM 1% 1/8W 0805; Manufacturer: Yageo; Power (Watts): 0.125W, 1/8W; Temperature Coefficient: ±100ppm/°C; Part Number: RC0805FR-07330RL; Value: 330 Ohms; ComponentLink1Description: Datasheet; ComponentLink1URL: https://www.yageo.com/upload/media/product/productsearch/datasheet/rchip/PYu-RC_Group_51_RoHS_L_10.pdf; ComponentLink2Description: DigiKey Link; ComponentLink2URL: http://digikey.com/product-detail/en/yageo/RC0805FR-07330RL/311-330CRCT-ND/730813; Composition: Thick Film; Device Package: 0805 (2012 Metric); Features: Moisture Resistant; Height - Seated (Max): 0.024" (0.60mm); LastUpdated: 2020. 09. 02. 1:15:14; Lifecycle Status: Active; Minimum Order: 1; Number of Terminations: 2; Operating Temperature: -55°C ~ 155°C; Package / Case: 0805 (2012 Metric); Packaging: CutTape; PartId: 32600; Part Status: Active; Price: 0.10; Resistance: 330 Ohms; Series: RC; Size / Dimension: 0.079" L x 0.049" W (2.00mm x 1.25mm); Supplier 1: DigiKey; Supplier Part Number 1: 311-330CRCT-ND; Supplier Device Package: 0805; Tolerance: ±1%
R20 = KTR10EZPF6200: RES SMD 620 OHM 1% 1/8W 0805; Manufacturer: Rohm Semiconductor; Power (Watts): 0.125W, 1/8W; Temperature Coefficient: ±100ppm/°C; Part Number: KTR10EZPF6200; Value: 620 Ohms; ComponentLink1Description: Datasheet; ComponentLink1URL: https://www.rohm.com/datasheet/KTR03EZPF/ktr-e; ComponentLink2Description: DigiKey Link; ComponentLink2URL: http://digikey.com/product-detail/en/rohm-semiconductor/KTR10EZPF6200/RHM620AHCT-ND/4054660; Composition: Thick Film; Device Package: 0805 (2012 Metric); Features: Automotive AEC-Q200, High Voltage; Height - Seated (Max): 0.026" (0.65mm); LastUpdated: 2020. 09. 02. 1:15:20; Lifecycle Status: Active; Minimum Order: 1; Number of Terminations: 2; Operating Temperature: -55°C ~ 155°C; Package / Case: 0805 (2012 Metric); Packaging: TapeAndReel; PartId: 29654; Part Status: Active; Price: 0.02; Ratings: AEC-Q200; Resistance: 620 Ohms; Series: KTR; Size / Dimension: 0.079" L x 0.049" W (2.00mm x 1.25mm); Supplier 1: DigiKey; Supplier Part Number 1: RHM620AHCT-ND; Supplier Device Package: 0805; Tolerance: ±1%
R21 = RMCF0805JT390R: RES 390 OHM 5% 1/8W 0805; Manufacturer: Stackpole Electronics Inc; Power (Watts): 0.125W, 1/8W; Temperature Coefficient: ±200ppm/°C; Part Number: RMCF0805JT390R; Value: 390 Ohms; ComponentLink1Description: Datasheet; ComponentLink1URL: https://www.seielect.com/catalog/sei-rmcf_rmcp.pdf; ComponentLink2Description: DigiKey Link; ComponentLink2URL: http://digikey.com/product-detail/en/stackpole-electronics-inc/RMCF0805JT390R/RMCF0805JT390RCT-ND/1942549; Composition: Thick Film; Device Package: 0805 (2012 Metric); Features: Automotive AEC-Q200; Height - Seated (Max): 0.026" (0.65mm); LastUpdated: 2020. 09. 02. 1:14:46; Lifecycle Status: Active; Minimum Order: 1; Number of Terminations: 2; Operating Temperature: -55°C ~ 155°C; Package / Case: 0805 (2012 Metric); Packaging: CutTape; PartId: 44650; Part Status: Active; Price: 0.10; Ratings: AEC-Q200; Resistance: 390 Ohms; Series: RMCF; Size / Dimension: 0.079" L x 0.049" W (2.00mm x 1.25mm); Supplier 1: DigiKey; Supplier Part Number 1: RMCF0805JT390RCT-ND; Supplier Device Package: 0805; Tolerance: ±5%
U1 U2 = TL974ID: Output Rail-To-Rail Very-Low-Noise Operational Amplifier, 2.7 to 12 V, -40 to 125 degC, 14-pin SOIC (D14), Green (RoHS & no Sb/Br); Manufacturer: Texas Instruments; CMRR(Min)(dB): 60; GBW(Typ)(MHz): 12; IIB(Max)(pA): 750000; Iq per channel(Max)(mA): 2.8; Number of Channels: 4; Offset Drift(Typ)(uV/C): 5; Rating: Catalog; Sub Family: General Purpose Amplifier, Low Supply Voltage Amplifier (<=2.7V); Total Supply Voltage(Min)(+5V is 5, +/-5V is 10): 2.7; DatasheetVersion: SLOS467G; PackageVersion: 4040047-5/M, 06/2011; PackageReference: D14; PackageDescription: 14-Pin Plastic Small Outline, Body 8.65 x 3.90 mm, Pitch 1.27 mm; Supplier 1: Digi-Key; Supplier Part Number 1: 296-34317-5-ND; Supplier 2: Farnell; Supplier Part Number 2: 1755227; Supplier 3: Newark; Supplier Part Number 3: 14M2459; Supplier 4: Mouser; Supplier Part Number 4: 595-TL974ID; Eco-Plan: Green (RoHS & no Sb/Br); Slew Rate(Typ)(V/us): 5; Total Supply Voltage(Max)(+5V is 5, +/-5V is 10): 12; Vio (25C)(Max)(mV): 4; Mounting Technology: Surface Mount; Code_JEDEC: MS-012; PartNumber: TL974ID; ComponentLink1Description: Manufacturer URL; ComponentLink1URL: http://www.ti.com/; ComponentLink2Description: Datasheet; ComponentLink2URL: http://www.ti.com/lit/ds/symlink/tl974.pdf; ComponentLink3Description: Package Specification; ComponentLink3URL: http://www.ti.com/lit/ml/mpds177g/mpds177g.pdf
U3 = STM32F070F6P6: No Description Available; SourceLibrary: Updates_to_database_2020-10-19; Built_By: EMA_UL_Team; Vendor: STMicroelectronics; Copyright: Copyright (C) 2018 Accelerated Designs. All rights reserved; Manufacturer_Part_Number: STM32F070F6P6; RefDes: RefDes; Type: DEV
U4 = LD1117S33TR: IC REG LINEAR 3.3V 800MA SOT223; Manufacturer: STMicroelectronics; Current - Quiescent (Iq): 10mA; Number of Regulators: 1; Output Configuration: Positive; Output Type: Fixed; Protection Features: Over Current, Over Temperature; PSRR: 75dB (120Hz); Voltage Dropout (Max): 1.2V @ 800mA; Voltage - Input (Max): 15V; Part Number: LD1117S33TR; ComponentLink1Description: Datasheet; ComponentLink1URL: http://www.st.com/content/ccc/resource/technical/document/datasheet/99/3b/7d/91/91/51/4b/be/CD00000544.pdf/files/CD00000544.pdf/jcr:content/translations/en.CD00000544.pdf; ComponentLink2Description: DigiKey Link; ComponentLink2URL: http://digikey.com/product-detail/en/stmicroelectronics/LD1117S33TR/497-1242-1-ND/586242; Current - Output: 800mA; LastUpdated: 2020. 09. 02. 1:24:39; Lifecycle Status: Active; Minimum Order: 1; Mounting Type: Surface Mount; Package / Case: TO-261-4, TO-261AA; Packaging: TapeAndReel; Part Status: Active; Price: 0.14; Series: -; Supplier 1: DigiKey; Supplier Part Number 1: 497-1242-1-ND; Supplier Device Package: SOT-223; Voltage - Output (Min/Fixed): 3.3V
VR1 = Bourns 3314G-1
X1 = ABLS-8.000MHZ-SD7Y-T: CRYSTAL 8.000MHZ 18PF SMD; Manufacturer: Abracon LLC; ESR (Equivalent Series Resistance): 80 Ohms; Frequency Stability: ±30ppm; Frequency Tolerance: ±15ppm; Operating Mode: Fundamental; Part Number: ABLS-8.000MHZ-SD7Y-T; ComponentLink1Description: Datasheet; ComponentLink1URL: https://abracon.com/Resonators/abls.pdf; ComponentLink2Description: DigiKey Link; ComponentLink2URL: http://digikey.com/product-detail/en/abracon-llc/ABLS-8.000MHZ-SD7Y-T/535-14365-1-ND/8582126; Frequency: 8MHz; Height - Seated (Max): 0.165" (4.20mm); LastUpdated: 2020. 09. 02. 1:21:46; Lifecycle Status: Active; Load Capacitance: 18pF; Minimum Order: 1; Mounting Type: Surface Mount; Operating Temperature: -40°C ~ 85°C; Package / Case: HC-49/US; Packaging: TapeAndReel; PartId: 25; Part Status: Active; Price: 0.24; Series: ABLS; Size / Dimension: 0.449" L x 0.185" W (11.40mm x 4.70mm); Supplier 1: DigiKey; Supplier Part Number 1: 535-14365-1-ND; Type: MHz Crystal; Value: 8MHz